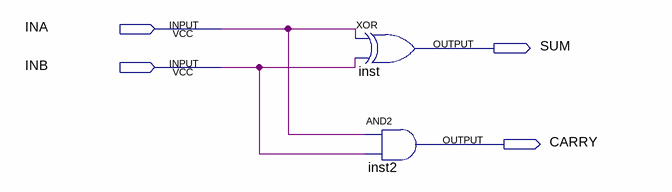
[diagram p0: schematic sheet]
// Quartus schematic half_adder.bdf as structural Verilog: 2 symbols, 4 pins
module half_adder (
  input  INA,
  input  INB,
  output SUM,
  output CARRY
);

  xor inst (SUM, INA, INB);
  and inst2 (CARRY, INA, INB);
endmodule
